# Altium schematic sheet Sch_Ethernet.SchDoc: Control de Domótica
size A4; Author: Francisco González González - Eugenia Ipar; CompanyName: Conexión a placa Ethernet; DocumentNumber: 12; SheetNumber: 12; SheetTotal: 12; Materia: Técnicas Digitales II; Placa: Conexión Ethernet; Year: 2015; Prof1: Prof: Alarcón, Juan; Prof2: Ayud: Crivelli, Marcelo; Prof3: Ayud: Montalti, Pablo; PageSetup: Record=PageOptions|CenterHorizontal=True|CenterVertical=True|PrintScale=1.00|XCorrection=1.00|YCorrection=1.00|PrintKind=0|BorderSize=5000000|LeftOffset=0|BottomOffset=0|Orientation=2|PaperLength=1000|PaperWidth=1000|Scale=100|PaperSource=7|PrintQuality=-3|MediaType=1|DitherType=10|PrintScaleMode=1|PaperKind=A4|PaperIndex=9
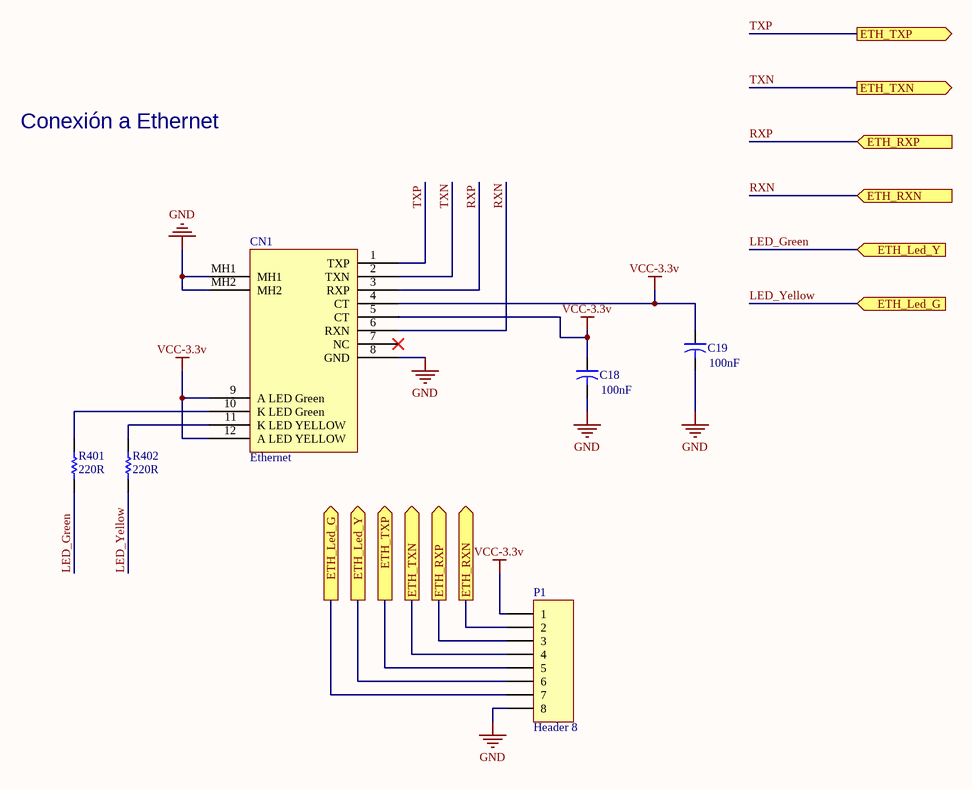
[diagram p0: Sch_Ethernet.SchDoc]

## Parts
C18  value 100nF  [CAPR5-4X5]  (hidden comment: Cap2)
C19  value 100nF  [CAPR5-4X5]  (hidden comment: Cap2)
CN1  Ethernet  [RJ45]
P1  Header 8  [HDR1X8]
R401  value 220R  [AXIAL-0.3]  (hidden comment: Res1)
R402  value 220R  [AXIAL-0.3]  (hidden comment: Res1)

## Ports
ETH_Led_G (in), ETH_Led_G (out), ETH_Led_Y (in), ETH_Led_Y (out), ETH_RXN (in), ETH_RXN (out), ETH_RXP (in), ETH_RXP (out), ETH_TXN (out), ETH_TXP (out)

## Nets
GND: C18.2 C19.2 CN1.8(GND) CN1.MH1 CN1.MH2 P1.8
VCC-3.3v: C18.1 C19.1 CN1.4(CT) CN1.5(CT) CN1.9(A_LED_Green) CN1.12(A_LED_YELLOW) P1.1
LED_Green: P1.6 R401.1 ; port ETH_Led_Y
LED_Yellow: P1.7 R402.1 ; port ETH_Led_G
RXN: CN1.6(RXN) P1.2 ; port ETH_RXN
RXP: CN1.3(RXP) P1.3 ; port ETH_RXP
TXN: CN1.2(TXN) P1.4 ; port ETH_TXN
TXP: CN1.1(TXP) P1.5 ; port ETH_TXP
NetCN1_10: CN1.10(K_LED_Green) R401.2
NetCN1_11: CN1.11(K_LED_YELLOW) R402.2

Not connected (* = marked no-connect by the designer): CN1 7(NC)*

## Notes on the sheet
- Conexión a Ethernet
- Sheet
- of

## Library data of the parts
C18 C19 = Cap2: Capacitor; Published: 23-Sep-2002; PackageReference: CAPR5-4X5; Publisher: Altium Limited; PackageDescription: Capacitor; 2 Leads
CN1 = Ethernet: RJ45 8pin Socket
P1 = Header 8: Header, 8-Pin; LatestRevisionDate: 17-Jul-2002; LatestRevisionNote: Re-released for DXP Platform.; Publisher: Altium Limited
R401 R402 = Res1: Resistor; Published: 8-Jun-2000; LatestRevisionDate: 17-Jul-2002; LatestRevisionNote: Re-released for DXP Platform.; PackageReference: AXIAL-0.3; Publisher: Altium Limited; PackageDescription: Axial Device, Thru-Hole; 2 Leads; 0.3 in Pin Spacing